# Altium schematic sheet Power Supply.SchDoc
size A; SheetNumber: 4; SheetTotal: 4
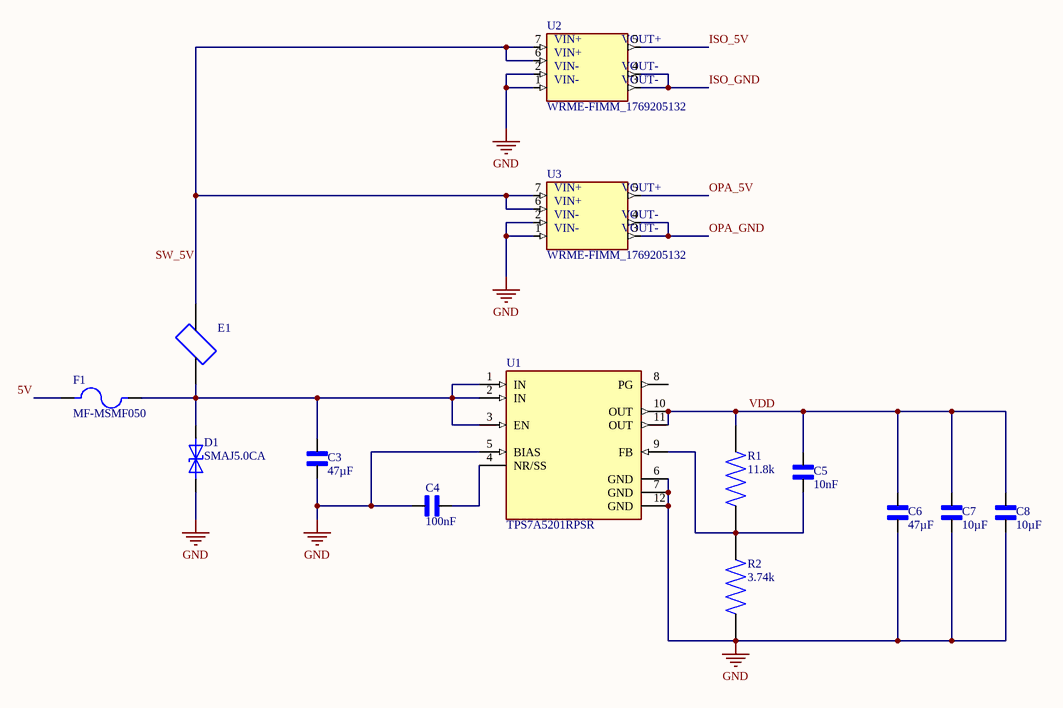
[diagram p0: Power Supply.SchDoc]

## Parts
C3  value 47µF  [CAPC3225X270N]  (hidden comment: CL32B476KPJNNWE)
C4  value 100nF  [CAPC2012X88N]  (hidden comment: C0805C104K6RACTU)
C5  value 10nF  [CAPC2012X88N]  (hidden comment: C0805C103J5RACTU)
C6  value 47µF  [CAPC3225X270N]  (hidden comment: CL32B476KPJNNWE)
C7  value 10µF  [CAPC3225X280N]  (hidden comment: C1210C106K5PACTU)
C8  value 10µF  [CAPC3225X280N]  (hidden comment: C1210C106K5PACTU)
D1  SMAJ5.0CA  [DIOM5126X229N]
E1  2-2176744-2  [BEADC2012X110N]  (value not drawn)
F1  MF-MSMF050  [FUSER_MF-MSMF050]
R1  value 11.8k  [RESC2012X50N]  (hidden comment: CRCW080511K8FKEC)
R2  value 3.74k  [RESC2012X50N]  (hidden comment: CRCW08053K74FKEA)
U1  TPS7A5201RPSR  [IC_TPS7A5201RPSR]
U2  WRME-FIMM_1769205132  [WRME-FIMM_1769205132]
U3  WRME-FIMM_1769205132  [WRME-FIMM_1769205132]

## Nets
GND: C3.2 C4.2 C6.2 C7.2 C8.2 D1.2 R2.2 U1.5(BIAS) U1.6(GND) U1.7(GND) U1.12(GND) U2.1 U2.2 U3.1 U3.2
5V: F1.1
ISO_5V: U2.5
ISO_GND: U2.3 U2.4
OPA_5V: U3.5
OPA_GND: U3.3 U3.4
SW_5V: E1.2 U2.6 U2.7 U3.6 U3.7
VDD: C5.2 C6.1 C7.1 C8.1 R1.1 U1.10(OUT) U1.11(OUT)
NetC3_1: C3.1 D1.1 E1.1 F1.2 U1.1(IN) U1.2(IN) U1.3(EN)
NetC4_1: C4.1 U1.4(NR/SS)
NetC5_1: C5.1 R1.2 R2.1 U1.9(FB)

Not connected (* = marked no-connect by the designer): U1 8(PG)

## Notes on the sheet
- (in symbol CMP-069-000000-2) VIN+; VOUT+; VIN-; VOUT-

## Library data of the parts
C3 C6 = CMP-001-00086-1: 47 ÂµF Â±10% 10V Ceramic Capacitor X7R 1210 (3225 Metric); MF: Samsung; Design Item ID: CL32B476KPJNNWE; Check_prices: https://www.snapeda.com/parts/CL32B476KPJNNWE/Samsung/view-part/?ref=eda; Source: CL32B476KPJNNWE.SchLib; Pins: 2; MP: CL32B476KPJNNWE; Component Type: Standard; Case/Package: SMD-2 Samsung; SnapEDA_Link: https://www.snapeda.com/parts/CL32B476KPJNNWE/Samsung/view-part/?ref=snap
C4 = CMP-001-00084-1: 0.1 ÂµF Â±10% 35V Ceramic Capacitor X7R 0805 (2012 Metric); MF: KEMET; Source: C0805C104K6RACTU.SchLib; SnapEDA_Link: https://www.snapeda.com/parts/C0805C104K6RACTU/KEMET/view-part/?ref=snap; MP: C0805C104K6RACTU; Pins: 2; Check_prices: https://www.snapeda.com/parts/C0805C104K6RACTU/KEMET/view-part/?ref=eda; Case/Package: 805-2 KEMET; Design Item ID: C0805C104K6RACTU; Component Type: Standard
C5 = CMP-001-00083-1: Capacitor;Ceramic;Cap 0.01uF;Tol 5%;Vol-Rtg 50 V;SMT;Case 0805;X7R;TR; MF: KEMET; Design Item ID: C0805C103J5RACTU; Pins: 2; Source: C0805C103J5RACTU.SchLib; Check_prices: https://www.snapeda.com/parts/C0805C103J5RACTU/KEMET/view-part/?ref=eda; Case/Package: 805-2 KEMET; MP: C0805C103J5RACTU; Component Type: Standard; SnapEDA_Link: https://www.snapeda.com/parts/C0805C103J5RACTU/KEMET/view-part/?ref=snap
C7 C8 = CMP-001-00085-1: 10 ÂµF Â±10% 50V Ceramic Capacitor X5R 1210 (3225 Metric); MF: KEMET; Source: C1210C106K5PACTU.SchLib; Pins: 2; Check_prices: https://www.snapeda.com/parts/C1210C106K5PACTU/KEMET/view-part/?ref=eda; Design Item ID: C1210C106K5PACTU; Component Type: Standard; MP: C1210C106K5PACTU; Case/Package: 3225 KEMET; SnapEDA_Link: https://www.snapeda.com/parts/C1210C106K5PACTU/KEMET/view-part/?ref=snap
D1 = CMP-004-00032-1: A 5.0V, 400W, bi-directional, SMA pkg TVS Diode; MF: Bourns; Pins: 2; SnapEDA_Link: https://www.snapeda.com/parts/SMAJ5.0CA/Bourns/view-part/?ref=snap; Design Item ID: SMAJ5.0CA; Source: SMAJ5.0CA.SchLib; Value: *; MP: SMAJ5.0CA; Case/Package: DO-214 Bourns; Check_prices: https://www.snapeda.com/parts/SMAJ5.0CA/Bourns/view-part/?ref=eda; Component Type: Standard
E1 = CMP-006-00023-2: 600 Ohms @ 100 MHz 1 Power Line Ferrite Bead 0805 (2012 Metric) 1.5A 250mOhm; MF: TE Connectivity Passive Product; SnapEDA_Link: https://www.snapeda.com/parts/2-2176744-2/TE/view-part/?ref=snap; Pins: 2; Case/Package: None; MP: 2-2176744-2; Source: 2-2176744-2.SchLib; Design Item ID: 2-2176744-2; Check_prices: https://www.snapeda.com/parts/2-2176744-2/TE/view-part/?ref=eda; Component Type: Standard
F1 = CMP-005-00013-1: Polymeric PTC Resettable Fuse 40V 500 mA Ih Surface Mount 1812 (4532 Metric), Concave; MF: Bourns; SnapEDA_Link: https://www.snapeda.com/parts/MF-MSMF050/Bourns/view-part/?ref=snap; Value: *; Component Type: Standard; Price: None; Check_prices: https://www.snapeda.com/parts/MF-MSMF050/Bourns/view-part/?ref=eda; Case/Package: 1812 Bourns; Availability: Not in stock; Pins: 2; Source: MF-MSMF050.SchLib; MP: MF-MSMF050; Design Item ID: MF-MSMF050
R1 = CMP-009-00177-1: Res Thick Film 0805 11.8K Ohm 1% 0.125W(1/8W) Â±100ppm/C Molded SMD Automotive Paper T/R; MF: Vishay; SnapEDA_Link: https://www.snapeda.com/parts/CRCW080511K8FKEC/Vishay/view-part/?ref=snap; Component Type: Standard; Check_prices: https://www.snapeda.com/parts/CRCW080511K8FKEC/Vishay/view-part/?ref=eda; Case/Package: 2012 Vishay; Source: CRCW080511K8FKEC.SchLib; Pins: 2; Design Item ID: CRCW080511K8FKEC; MP: CRCW080511K8FKEC
R2 = CMP-009-00178-1: Resistor;Thick Film;3.74 Kilohms;0.125 W;1%;SMT;0805;TCR 37 ppm/DegC;TR; MF: Vishay Dale; SnapEDA_Link: https://www.snapeda.com/parts/CRCW08053K74FKEA/Vishay+Dale/view-part/?ref=snap; Component Type: Standard; Source: CRCW08053K74FKEA.SchLib; Pins: 2; Check_prices: https://www.snapeda.com/parts/CRCW08053K74FKEA/Vishay+Dale/view-part/?ref=eda; Case/Package: 2012 Vishay; Design Item ID: CRCW08053K74FKEA; MP: CRCW08053K74FKEA
U1 = CMP-031-000000-2: LDO; MF: {'manufacturer': u'Texas Instruments'}; Package: None; Source: TPS7A5201RPSR.SchLib; MP: TPS7A5201RPSR; Pin Count: 12; Value: *; Availability: Unavailable; Component Type: Standard; Design Item ID: TPS7A5201RPSR; Price: None
U2 U3 = CMP-069-000000-2: LGA-7 / 5Vin / 5Vout / 1W / 3kV / 9 x 7 x 3.1mm / short circuit protection; MF: Wurth Elektronik; Package: None; Check_prices: https://www.snapeda.com/parts/1769205132/Wurth+Electronics/view-part/?ref=eda; MP: 1769205132; Design Item ID: WRME-FIMM_1769205132; Source: WRME-FIMM_1769205132.SchLib; Pin Count: 7; Component Type: Standard; Value: *; SnapEDA_Link: https://www.snapeda.com/parts/1769205132/Wurth+Electronics/view-part/?ref=snap